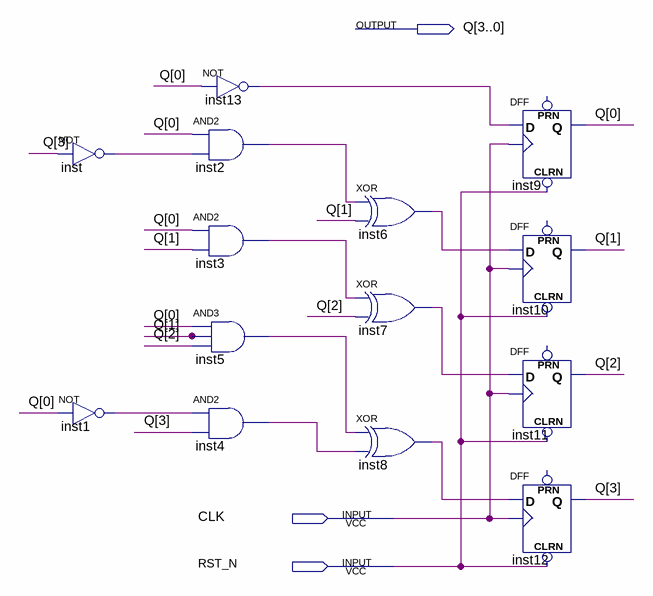
[diagram p0: schematic sheet]
// Quartus schematic bcd1cnt.bdf as structural Verilog: 14 symbols, 3 pins
module bcd1cnt (
  input  CLK,
  input  RST_N,
  output [3:0] Q
);

  wire inst1_out, inst2_out, inst3_out, inst4_out, inst5_out, inst6_out, inst7_out, inst8_out, inst13_out,
       inst_out;

  not inst (inst_out, Q[3]);
  not inst1 (inst1_out, Q[0]);
  not inst13 (inst13_out, Q[0]);
  and inst2 (inst2_out, Q[0], inst_out);
  and inst3 (inst3_out, Q[0], Q[1]);
  and inst5 (inst5_out, Q[0], Q[1], Q[2]);
  and inst4 (inst4_out, inst1_out, Q[3]);
  xor inst6 (inst6_out, inst2_out, Q[1]);
  xor inst7 (inst7_out, inst3_out, Q[2]);
  xor inst8 (inst8_out, inst5_out, inst4_out);
  DFF inst9 (.CLRN(RST_N), .CLK(CLK), .D(inst13_out), .Q(Q[0]));  // open: PRN
  DFF inst10 (.CLRN(RST_N), .CLK(CLK), .D(inst6_out), .Q(Q[1]));  // open: PRN
  DFF inst11 (.CLRN(RST_N), .CLK(CLK), .D(inst7_out), .Q(Q[2]));  // open: PRN
  DFF inst12 (.CLRN(RST_N), .CLK(CLK), .D(inst8_out), .Q(Q[3]));  // open: PRN
endmodule
